# Altium schematic sheet bio_dnt_main.SchDoc: Индикатор токов биочипа(ИТБ)
size 410 x 297 mm; ApprovedBy: Прокопьев; CheckedBy: Прокопьев; Author: Стюф; Organization: НГУ; DocumentNumber: ЮМП.445.020.51 Э3; SheetNumber: 1; SheetTotal: 3; PageSetup: Record=PageOptions|CenterHorizontal=True|CenterVertical=True|PrintScale=1.00|XCorrection=1.00|YCorrection=1.00|PrintKind=1|BorderSize=5000000|LeftOffset=0|BottomOffset=0|Orientation=2|PaperLength=1000|PaperWidth=1000|Scale=100|PaperSource=15|PrintQuality=1200|MediaType=1|DitherType=10|PaperKind=A3|PrintScaleMode=1; Weight: -; ScaleFactor: 1-1
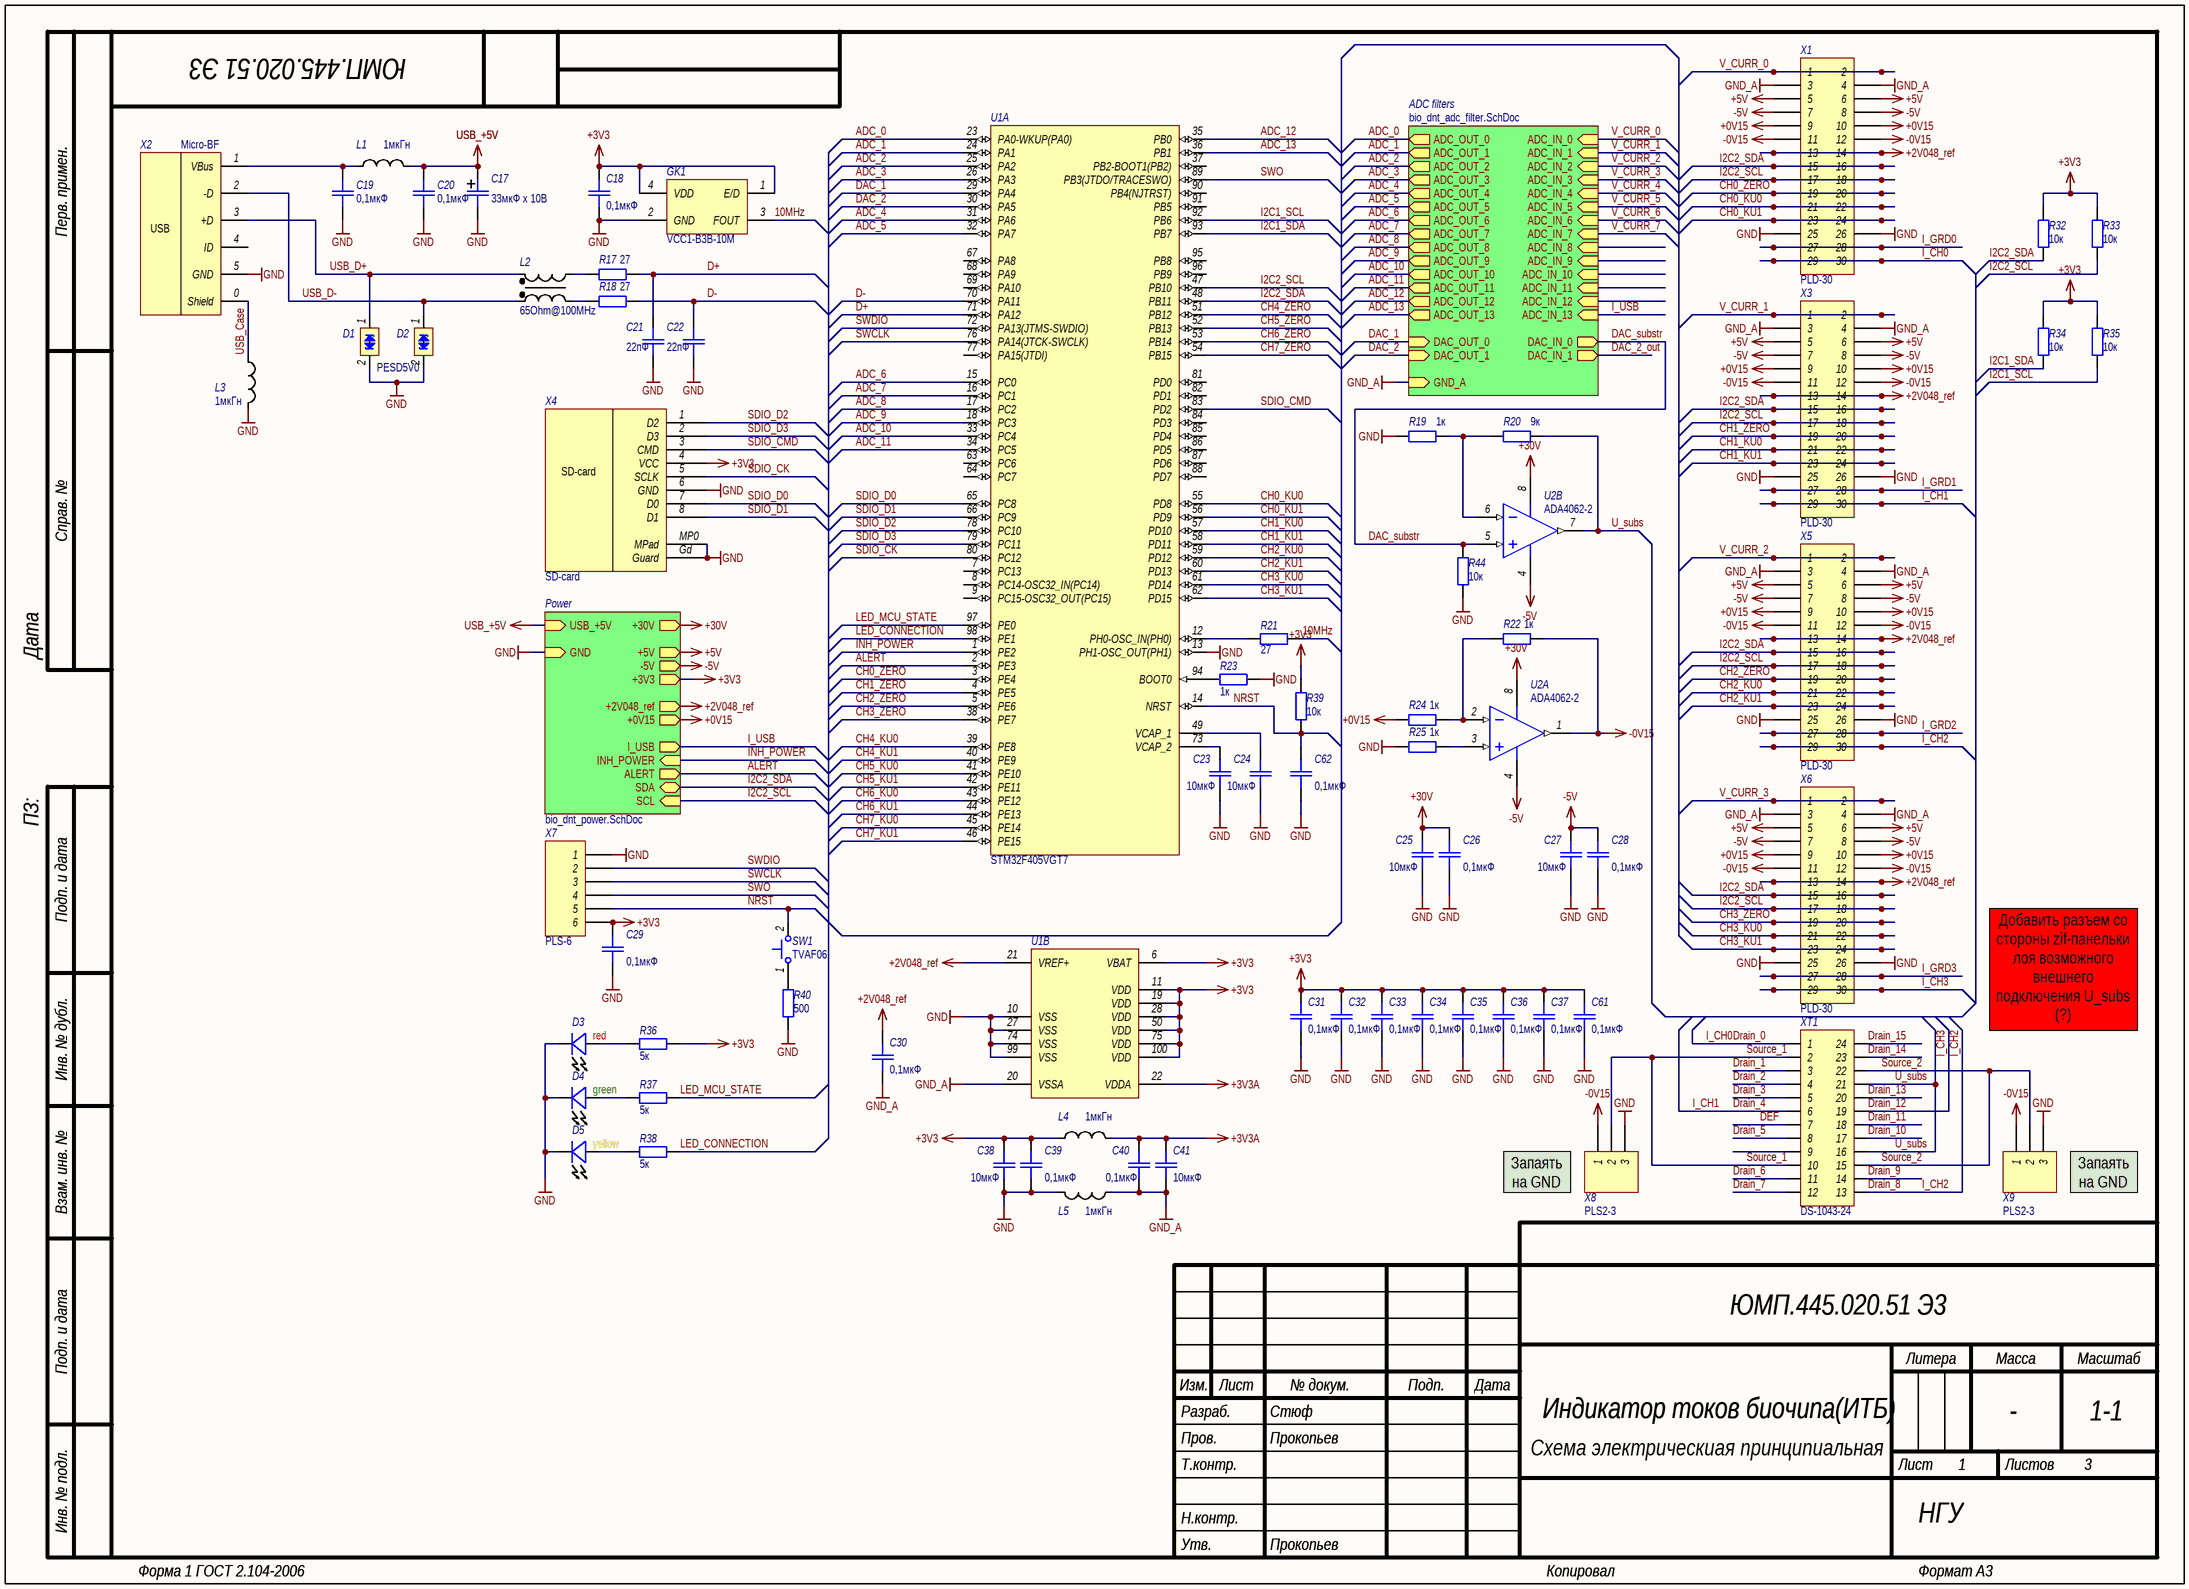
[diagram p0: bio_dnt_main.SchDoc]

## Parts
C17  33мкФ х 10В  [C_SMD_size_C]
C18  0,1мкФ  [CR-0805]
C19  0,1мкФ  [CR-0805]
C20  0,1мкФ  [CR-0805]
C21  22пФ  [CR-0805]
C22  22пФ  [CR-0805]
C23  10мкФ  [CR-0805]
C24  10мкФ  [CR-0805]
C25  10мкФ  [CR-0805]
C26  0,1мкФ  [CR-0805]
C27  10мкФ  [CR-0805]
C28  0,1мкФ  [CR-0805]
C29  0,1мкФ  [CR-0805]
C30  0,1мкФ  [CR-0805]
C31  0,1мкФ  [CR-0805]
C32  0,1мкФ  [CR-0805]
C33  0,1мкФ  [CR-0805]
C34  0,1мкФ  [CR-0805]
C35  0,1мкФ  [CR-0805]
C36  0,1мкФ  [CR-0805]
C37  0,1мкФ  [CR-0805]
C38  10мкФ  [CR-0805]
C39  0,1мкФ  [CR-0805]
C40  0,1мкФ  [CR-0805]
C41  10мкФ  [CR-0805]
C61  0,1мкФ  [CR-0805]
C62  0,1мкФ  [CR-0805]
D1  PESD5V0  [SOD-323]
D2  PESD5V0  [SOD-323]  (value not drawn)
D3  value red  [LED-0805]  (hidden comment: LED)
D4  value green  [LED-0805]  (hidden comment: LED)
D5  value yellow  [LED-0805]  (hidden comment: LED)
GK1  Наименование: VCC1-B3B-10M  [5x7 Crystall Oscillatior]  (hidden comment: VCC1)
L1  1мкГн  [CR-1206]
L2  65Ohm@100MHz  [ACM2012]
L3  1мкГн  [CR-1206-0805]
L4  1мкГн  [CR-1206-0805]
L5  1мкГн  [CR-1206-0805]
R17  27  [CR-0805]
R18  27  [CR-0805]
R19  1к  [CR-0805]
R20  9к  [CR-0805]
R21  27  [CR-0805]
R22  1к  [CR-0805]
R23  1к  [CR-0805]
R24  1к  [CR-0805]
R25  1к  [CR-0805]
R32  10к  [CR-0805]
R33  10к  [CR-0805]
R34  10к  [CR-0805]
R35  10к  [CR-0805]
R36  5к  [CR-0805]
R37  5к  [CR-0805]
R38  5к  [CR-0805]
R39  10к  [CR-0805]
R40  500  [CR-0805]
R44  10к  [CR-0805]
SW1  Push button  [TVAF06]  (value not drawn)
U1  STM32F405VGT7  [LQFP100]  (parts A,B of 2)
U2  ADA4062-2ARZ  [SOIC-8]  (value not drawn)  (parts A,B of 2)
X1  Наименование: PLD-30  [HDR2X15]  (hidden comment: HDR2X15)
X2  Наименование: Micro-BF  [USB Micro-BF]  (hidden comment: mico-BF)
X3  Наименование: PLD-30  [HDR2X15]  (hidden comment: HDR2X15)
X4  SD-card  [SD-card holder]
X5  Наименование: PLD-30  [HDR2X15]  (hidden comment: HDR2X15)
X6  Наименование: PLD-30  [HDR2X15]  (hidden comment: HDR2X15)
X7  Наименование: PLS-6  [HDR1X6]  (hidden comment: Header 6)
X8  Наименование: PLS2-3  [MHDR1X3]  (hidden comment: MHDR1X3)
X9  Наименование: PLS2-3  [MHDR1X3]  (hidden comment: MHDR1X3)
XT1  DS-1043-24  [DS-1043-24]

## Sub-sheets
ADC filters = bio_dnt_adc_filter.SchDoc: ADC_OUT_4 (out), ADC_OUT_5 (out), ADC_OUT_2 (out), ADC_OUT_1 (out), ADC_OUT_3 (out), ADC_OUT_7 (out), ADC_OUT_6 (out), ADC_OUT_8 (out), ADC_OUT_0 (out), ADC_OUT_9 (out), ADC_OUT_10 (out), ADC_OUT_11 (out), ADC_OUT_12 (out), ADC_OUT_13 (out), ADC_IN_10 (in), ADC_IN_11 (in), ADC_IN_3 (in), ADC_IN_12 (in), ADC_IN_6 (in), ADC_IN_7 (in), ADC_IN_5 (in), ADC_IN_4 (in), ADC_IN_8 (in), ADC_IN_1 (in), ADC_IN_0 (in), ADC_IN_9 (in), ADC_IN_13 (in), ADC_IN_2 (in), DAC_OUT_0 (in), DAC_IN_1 (out), DAC_OUT_1 (in), DAC_IN_0 (out), GND_A (in)
Power = bio_dnt_power.SchDoc: -5V (out), +0V15 (out), +3V3 (out), +30V (out), +5V (out), USB_+5V (in), GND (in), +2V048_ref (out), I_USB (out), SDA (bidir), SCL (in), ALERT (out), INH_POWER (in)

## Nets
+0V15: R24.2 X1.9 X1.10 X3.9 X3.10 X5.9 X5.10 X6.9 X6.10 ; sheet Power/+0V15
+2V048_ref: C30.2 U1.21(VREF+) X1.13 X1.14 X3.13 X3.14 X5.13 X5.14 X6.13 X6.14 ; sheet Power/+2V048_ref
+3V3: C18.2 C29.2 C31.2 C32.2 C33.2 C34.2 C35.2 C36.2 C37.2 C38.2 C39.2 C61.2 GK1.1(E/D) GK1.4(VDD) L4.1 R32.1 R33.1 R34.1 R35.1 R36.1 R39.1 U1.6(VBAT) U1.11(VDD) U1.19(VDD) U1.28(VDD) U1.50(VDD) U1.75(VDD) U1.100(VDD) X4.4(VCC) X7.6 ; sheet Power/+3V3
+3V3A: C40.2 C41.2 L4.2 U1.22(VDDA)
+5V: X1.5 X1.6 X3.5 X3.6 X5.5 X5.6 X6.5 X6.6 ; sheet Power/+5V
+30V: C25.2 C26.2 U2.8(+V) ; sheet Power/+30V
-0V15: R22.1 U2.1(OUT_A) X1.11 X1.12 X3.11 X3.12 X5.11 X5.12 X6.11 X6.12 X8.1 X9.1
-5V: C27.2 C28.2 U2.4(-V) X1.7 X1.8 X3.7 X3.8 X5.7 X5.8 X6.7 X6.8 ; sheet Power/-5V
GND: C17.2 C18.1 C19.1 C20.1 C21.1 C22.1 C23.1 C24.1 C25.1 C26.1 C27.1 C28.1 C29.1 C31.1 C32.1 C33.1 C34.1 C35.1 C36.1 C37.1 C38.1 C39.1 C61.1 C62.1 D1.2(cathode_2) D2.2(cathode_2) D3.2(K) D4.2(K) D5.2(K) GK1.2(GND) L3.2 L5.2 R19.2 R23.1 R25.2 R40.1 R44.2 U1.10(VSS) U1.13(PH1-OSC_OUT(PH1)) U1.27(VSS) U1.74(VSS) U1.99(VSS) X1.25 X1.26 X2.5(GND) X3.25 X3.26 X4.6(GND) X4.Gd(Guard) X4.MP0(MPad) X5.25 X5.26 X6.25 X6.26 X7.1 X8.3 X9.3 ; sheet Power/GND
GND_A: C30.1 C40.1 C41.1 L5.1 U1.20(VSSA) X1.3 X1.4 X3.3 X3.4 X5.3 X5.4 X6.3 X6.4 ; sheet ADC filters/GND_A
USB_+5V: C17.1 C20.2 L1.2 ; sheet Power/USB_+5V
10MHz: GK1.3(FOUT) R21.2
ADC_0: U1.23(PA0-WKUP(PA0)) ; sheet ADC filters/ADC_OUT_0
ADC_1: U1.24(PA1) ; sheet ADC filters/ADC_OUT_1
ADC_2: U1.25(PA2) ; sheet ADC filters/ADC_OUT_2
ADC_3: U1.26(PA3) ; sheet ADC filters/ADC_OUT_3
ADC_4: U1.31(PA6) ; sheet ADC filters/ADC_OUT_4
ADC_5: U1.32(PA7) ; sheet ADC filters/ADC_OUT_5
ADC_6: U1.15(PC0) ; sheet ADC filters/ADC_OUT_6
ADC_7: U1.16(PC1) ; sheet ADC filters/ADC_OUT_7
ADC_8: U1.17(PC2) ; sheet ADC filters/ADC_OUT_8
ADC_9: U1.18(PC3) ; sheet ADC filters/ADC_OUT_9
ADC_10: U1.33(PC4) ; sheet ADC filters/ADC_OUT_10
ADC_11: U1.34(PC5) ; sheet ADC filters/ADC_OUT_11
ADC_12: U1.35(PB0) ; sheet ADC filters/ADC_OUT_12
ADC_13: U1.36(PB1) ; sheet ADC filters/ADC_OUT_13
ALERT: U1.2(PE3) ; sheet Power/ALERT
CH0_KU0: U1.55(PD8) X1.21 X1.22
CH0_KU1: U1.56(PD9) X1.23 X1.24
CH0_ZERO: U1.3(PE4) X1.19 X1.20
CH1_KU0: U1.57(PD10) X3.21 X3.22
CH1_KU1: U1.58(PD11) X3.23 X3.24
CH1_ZERO: U1.4(PE5) X3.19 X3.20
CH2_KU0: U1.59(PD12) X5.21 X5.22
CH2_KU1: U1.60(PD13) X5.23 X5.24
CH2_ZERO: U1.5(PE6) X5.19 X5.20
CH3_KU0: U1.61(PD14) X6.21 X6.22
CH3_KU1: U1.62(PD15) X6.23 X6.24
CH3_ZERO: U1.38(PE7) X6.19 X6.20
CH4_KU0: U1.39(PE8)
CH4_KU1: U1.40(PE9)
CH4_ZERO: U1.51(PB12)
CH5_KU0: U1.41(PE10)
CH5_KU1: U1.42(PE11)
CH5_ZERO: U1.52(PB13)
CH6_KU0: U1.43(PE12)
CH6_KU1: U1.44(PE13)
CH6_ZERO: U1.53(PB14)
CH7_KU0: U1.45(PE14)
CH7_KU1: U1.46(PE15)
CH7_ZERO: U1.54(PB15)
D+: C21.2 R17.1 U1.71(PA12)
D-: C22.2 R18.1 U1.70(PA11)
DAC_1: U1.29(PA4) ; sheet ADC filters/DAC_OUT_0
DAC_2: U1.30(PA5) ; sheet ADC filters/DAC_OUT_1
DAC_2_out: sheet ADC filters/DAC_IN_1
DAC_substr: R44.1 U2.5(+IN_B) ; sheet ADC filters/DAC_IN_0
DEF: XT1.7
Drain_0: X1.29 X1.30 XT1.1  [also labelled I_CH0]
Drain_1: XT1.3
Drain_2: XT1.4
Drain_3: XT1.5
Drain_4: X3.29 X3.30 XT1.6  [also labelled I_CH1]
Drain_5: XT1.8
Drain_6: XT1.11
Drain_7: XT1.12
Drain_8: X5.29 X5.30 XT1.13  [also labelled I_CH2]
Drain_9: XT1.14
Drain_10: XT1.17
Drain_11: XT1.18
Drain_12: X6.29 X6.30 XT1.19  [also labelled I_CH3]
Drain_13: XT1.20
Drain_14: XT1.23
Drain_15: XT1.24
I2C1_SCL: R35.2 U1.92(PB6)
I2C1_SDA: R34.2 U1.93(PB7)
I2C2_SCL: R33.2 U1.47(PB10) X1.17 X1.18 X3.17 X3.18 X5.17 X5.18 X6.17 X6.18 ; sheet Power/SCL
I2C2_SDA: R32.2 U1.48(PB11) X1.15 X1.16 X3.15 X3.16 X5.15 X5.16 X6.15 X6.16 ; sheet Power/SDA
I_GRD0: X1.27 X1.28
I_GRD1: X3.27 X3.28
I_GRD2: X5.27 X5.28
I_GRD3: X6.27 X6.28
I_USB: sheet Power/I_USB, sheet ADC filters/ADC_IN_13
INH_POWER: U1.1(PE2) ; sheet Power/INH_POWER
LED_CONNECTION: R38.1 U1.98(PE1)
LED_MCU_STATE: R37.1 U1.97(PE0)
NRST: C62.2 R39.2 SW1.2 U1.14(NRST) X7.5
SDIO_CK: U1.80(PC12) X4.5(SCLK)
SDIO_CMD: U1.83(PD2) X4.3(CMD)
SDIO_D0: U1.65(PC8) X4.7(D0)
SDIO_D1: U1.66(PC9) X4.8(D1)
SDIO_D2: U1.78(PC10) X4.1(D2)
SDIO_D3: U1.79(PC11) X4.2(D3)
Source_1: X8.2 XT1.2 XT1.10
Source_2: X9.2 XT1.15 XT1.22
SWCLK: U1.76(PA14(JTCK-SWCLK)) X7.3
SWDIO: U1.72(PA13(JTMS-SWDIO)) X7.2
SWO: U1.89(PB3(JTDO/TRACESWO)) X7.4
U_subs: R20.1 U2.7(OUT_B) XT1.16 XT1.21
USB_Case: L3.1 X2.0(Shield)
USB_D+: D1.1(cathode_1) L2.2 X2.3(+D)
USB_D-: D2.1(cathode_1) L2.1 X2.2(-D)
V_CURR_0: X1.1 X1.2 ; sheet ADC filters/ADC_IN_0
V_CURR_1: X3.1 X3.2 ; sheet ADC filters/ADC_IN_1
V_CURR_2: X5.1 X5.2 ; sheet ADC filters/ADC_IN_2
V_CURR_3: X6.1 X6.2 ; sheet ADC filters/ADC_IN_3
V_CURR_4: sheet ADC filters/ADC_IN_4
V_CURR_5: sheet ADC filters/ADC_IN_5
V_CURR_6: sheet ADC filters/ADC_IN_6
V_CURR_7: sheet ADC filters/ADC_IN_7
NetC19_2: C19.2 L1.1 X2.1(VBus)
NetC23_2: C23.2 U1.73(VCAP_2)
NetC24_2: C24.2 U1.49(VCAP_1)
NetD3_1: D3.1(A) R36.2
NetD4_1: D4.1(A) R37.2
NetD5_1: D5.1(A) R38.2
NetL2_3: L2.3 R17.2
NetL2_4: L2.4 R18.2
NetR19_1: R19.1 R20.2 U2.6(-IN_B)
NetR21_1: R21.1 U1.12(PH0-OSC_IN(PH0))
NetR22_2: R22.2 R24.1 U2.2(-IN_A)
NetR23_2: R23.2 U1.94(BOOT0)
NetR25_1: R25.1 U2.3(+IN_A)
NetR40_2: R40.2 SW1.1

Not connected (* = marked no-connect by the designer): U1 7(PC13) 8(PC14-OSC32_IN(PC14)) 9(PC15-OSC32_OUT(PC15)) 37(PB2-BOOT1(PB2)) 63(PC6) 64(PC7) 67(PA8) 68(PA9) 69(PA10) 77(PA15(JTDI)) 81(PD0) 82(PD1) 84(PD3) 85(PD4) 86(PD5) 87(PD6) 88(PD7) 90(PB4(NJTRST)) 91(PB5) 95(PB8) 96(PB9); X2 4(ID); XT1 9

## Notes on the sheet
- Добавить разъем со стороны zif-панельки лоя возможного внешнего подключения U_subs (?)
- (near X8) Запаять на GND
- (near X9) Запаять на GND
- Перв. примен.
- Справ. №
- ПЗ:                             Дата
- Подп. и дата
- Инв. № дубл.
- Взам. инв. №
- Разраб.
- Изм.
- Лист
- № докум.
- Подп.
- Дата
- Литера
- Масса
- Масштаб
- Пров.
- Т.контр.
- Схема электрическиая принципиальная
- Листов
- Инв. № подл.
- Н.контр.
- Утв.
- Форма 1 ГОСТ 2.104-2006
- Копировал
- Формат А3
- (in symbol MicroUSB) USB

## Library data of the parts
C17 = C_pol_smd: Поляризованный конеднсатор для поверхностного монтажа; Назначение: Поляризованный чип-конденсатор; Наименование: К53-68 «ВП»; Потребление, Вт: 0; Value: 33мкФ х 10В
C18-C41 C61 C62 = C_smd: Конденсатор для поверхностного монтажа; Назначение: Чип-конденсатор; Наименование: К10-79 МП0 «ВП»; Потребление, Вт: 0
  C18-C20 C26 C28-C37 C39 C40 C61 C62: Value: 0,1мкФ
  C21 C22: Value: 22пФ
  C23-C25 C27 C38 C41: Value: 10мкФ
D1 D2 = PESD5V0S: Low capacitance bidirectional ESD protection diodes; Назначение: ESD защитные диоды; Потребление, Вт: 0,000; Наименование: PESD5V0S1BA
D3-D5 = LED: Назначение: Светодиод; Наименование: SMD-LED; Потребление, Вт: 0,01
GK1 = Crystall Oscillator: Назначение: Кварцевый генератор 7x5мм 20 МГц; Потребление, Вт: 0,01
L1 L3-L5 = L_smd: Индуктивность для поверхностнгого монтажа; Назначение: Чип-индуктивность; Потребление, Вт: 0,010; Value: 1мкГн; Наименование: Индуктивность
L2 = ACM2012_USB_CM_FILTER: USB common mode filter; Назначение: Связанная индуктивность; Наименование: ACM2012-900-2P; Потребление, Вт: 0,001; Value: 65Ohm@100MHz
R17-R25 R32-R40 R44 = R_smd: Резистор для поверхностного монтажа; Наименование: Р1-12-0.125 ОСМ; Назначение: Чип-резистор; Потребление, Вт: 0,001
  R17 R18 R21: Value: 27
  R19 R22-R25: Value: 1к
  R20: Value: 9к
  R32-R35 R39 R44: Value: 10к
  R36-R38: Value: 5к
  R40: Value: 500
SW1 = Push_Button: Потребление, Вт: 0,001; Назначение: Push button; Наименование: TVAF06
U1 = STM32F405VGT: ARM Cortex-M4 32-bit MCU+FPU, 210 DMIPS, 1024 kB Flash, 192 kB Internal RAM, 82 I/Os, 100-pin LQFP, -40 to 105 degC, Tray; Manufacturer: STMicroelectronics; Supply Voltage(Vcc) min (V): 1.8; D/A Converter: 2x12-bit; Operating Frequency(F) (Processor speed) (MHz): 168; I/Os (High Current): 82; Internal RAM Size (kB): 192; FLASH Size (Prog) (kB): 1024; Supply Voltage(Vcc) max (V): 3.6; Назначение: Микроконтроллер; Core: ARM Cortex-M4; PartNumber: STM32F405VGT7; ComponentLink3Description: Package Specification; ComponentLink1Description: Manufacturer URL; PackageDescription: 100-Pin Low Profile Quad Flat Package, 14 x 14 mm Body, 0.5 mm Pitch; DatasheetVersion: Rev. 4; ComponentLink3URL: http://www.st.com/st-web-ui/static/active/en/resource/technical/document/data_brief/DM00071938.pdf; PackageReference: LQFP100; ComponentLink2Description: Datasheet; PackageVersion: Rev. 1, 06/2013; ComponentLink2URL: http://www.st.com/st-web-ui/static/active/en/resource/technical/document/datasheet/DM00037051.pdf; Packing: Tray; ComponentLink1URL: http://www.st.com/web/en/home.html; Mounting Technology: Surface Mount; Наименование: STM32F405VGT7
U2 = ADA4062-2: Double Channel Low Supply Current Operational Amplifier, 1.4 MHz BW, 3.3 V/us SR, Industrial, 8-pin SOIC (R-8), Tube; Manufacturer: Analog Devices; Input Bias Current: 2pA; Amplifiers Per Package: 2; Input Offset Voltage: 500uV; V Span Max: 36V; Small Signal Bandwidth: 1.4MHz; V Span Min: 8V; Iq/Amp: 165uA; Назначение: Сдвоенный операционный усилитель; ComponentLink1Description: Manufacturer URL; ComponentLink2Description: Datasheet; PartNumber: ADA4062-2ARZ; PackageVersion: 060506-A; PackageDescription: 8-Pin Standard Small Outline Package, Body 3.9 x 4.9 mm, Pitch 1.27 mm; ComponentLink3URL: http://www.analog.com/static/imported-files/packages/PKG_PDF/SOIC_Narrow%20(R)/R_8.pdf; Code_JEDEC: MS-012-AA; Mounting Technology: Surface Mount; PackageReference: R-8; Generic Part Number: ADA4062-2; ComponentLink4URL: Reference Circuit:http://www.analog.com/en/all-operational-amplifiers-op-amps/operational-amplifiers-op-amps/ada4062-2/products/product.html#product-recommendations; ComponentLink4Description: URL Link1; Slew Rate: 3.3V/us; DatasheetVersion: Rev. B; ComponentLink1URL: http://www.analog.com/en/index.html; ComponentLink2URL: http://www.analog.com/static/imported-files/data_sheets/ADA4062-2_4062-4.pdf; ComponentLink3Description: Package Specification; Parameter 1: *; Наименование: ADA4062-2
X1 X3 X5 X6 = HDR2X15: Header, 15-Pin, Dual row; Назначение: Вилка штыревая 2.54мм 2х15 прямая; LatestRevisionDate: 17-Jul-2002; LatestRevisionNote: Re-released for DXP Platform.; Publisher: Altium Limited
X2 = MicroUSB: USB mico-BF; Назначение: Разъем на плату
X4 = SD-card holder: Назначение: Слот под SD-карту; Наименование: SD-card
X7 = Header 6: Header, 6-Pin; Назначение: Отладочный разъем; LatestRevisionDate: 17-Jul-2002; LatestRevisionNote: Re-released for DXP Platform.; Publisher: Altium Limited
X8 X9 = MHDR1X3: Header, 3-Pin; Назначение: Вилка штыревая 2мм 1х3 прямая; LatestRevisionDate: 17-Jul-2002; LatestRevisionNote: Re-released for DXP Platform.; Publisher: Altium Limited
XT1 = DS-1043-24: DIP-24 Zero Insertion Force (ZIF) socket; Назначение: Панель с нулевым усилием (ZIF) для DIP-24; Наименование: DS-1043-24